# Altium schematic sheet mcu.SchDoc
size A4
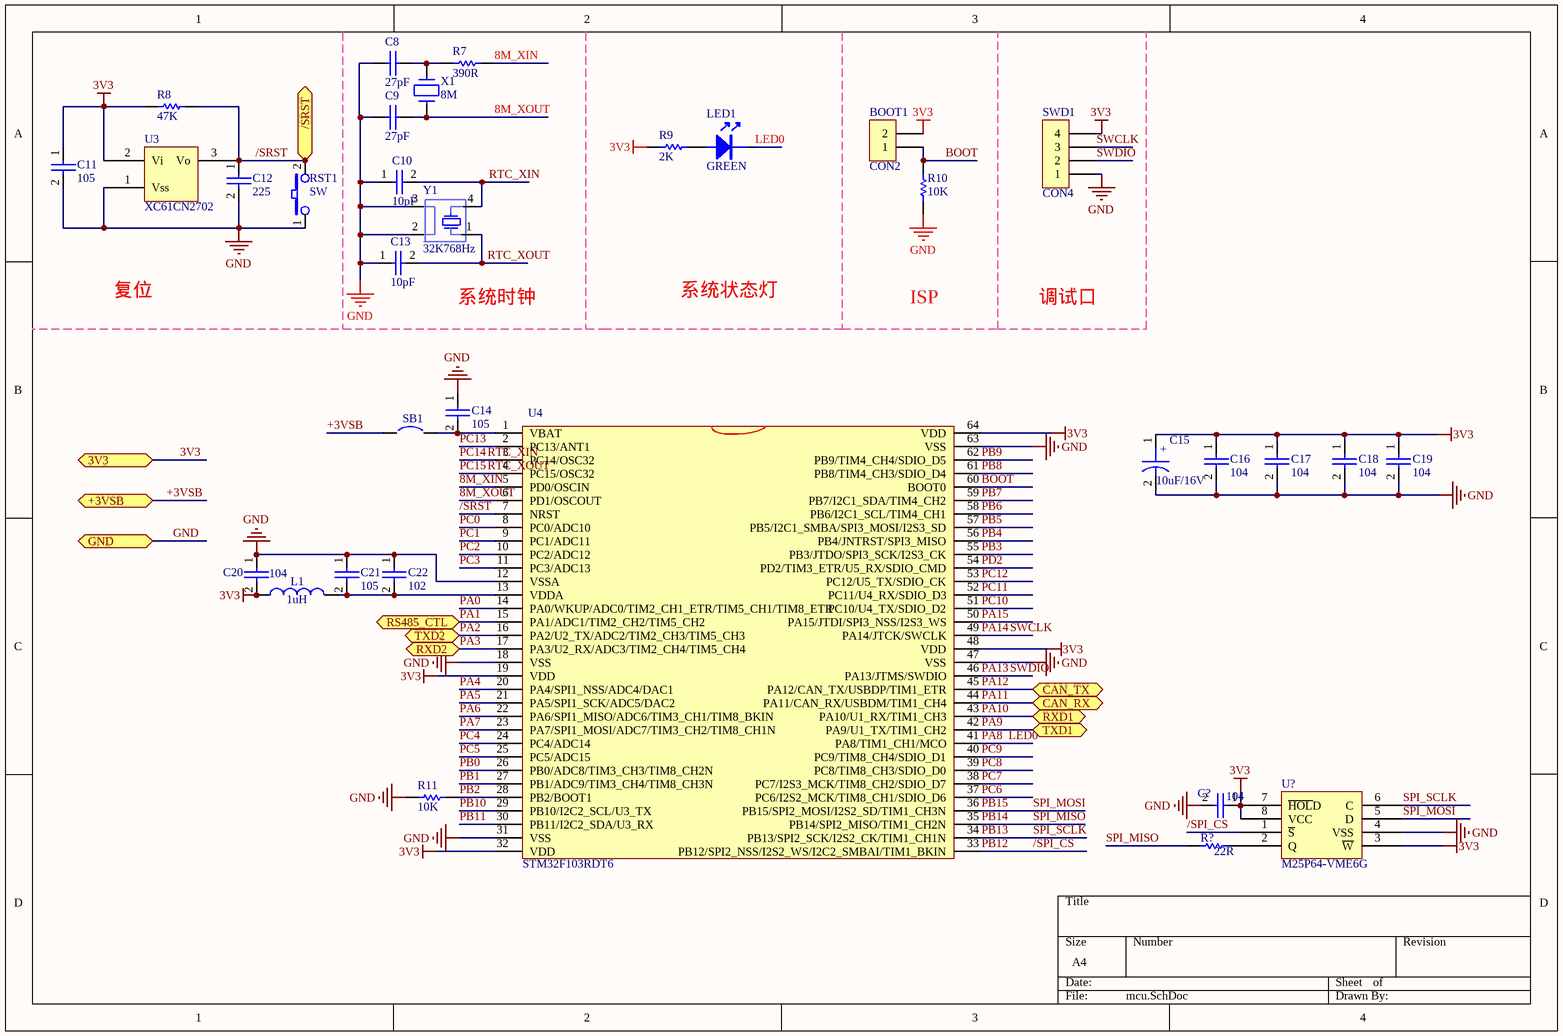
[diagram p0: mcu.SchDoc]

## Parts
BOOT1  CON2  [SIP2]
C8  27pF  [0603C]
C9  27pF  [0603C]
C10  10pF  [0603C]
C11  105  [0603C]
C12  225  [0805]
C13  10pF  [0603C]
C14  105  [0603C]
C15  10uF/16V  [TAN-B]
C16  104  [0603C]
C17  104  [0603C]
C18  104  [0603C]
C19  104  [0603C]
C20  104  [0603C]
C21  105  [0603C]
C22  102  [0603C]
C?  104  [0603C]
L1  1uH  [0603C]
LED1  GREEN  [LED-0603]
R7  390R  [0603C]
R8  47K  [0603C]
R9  2K  [0603C]
R10  10K  [0603C]
R11  10K  [0603R]
R?  22R  [0603C]
RST1  SW  [5032-s]
SB1  Circuit Breaker  [JP2_SMD-2]  (value not drawn)
SWD1  CON4  [SIP4]
U3  XC61CN2702  [XC61CN2702]
U4  STM32F103RDT6  [LQFP64_M]
U?  M25P64-VME6G  [VDFPN8]
X1  8M  [XTAL]
Y1  32K768Hz  [32K768Hz]

## Ports
3V3, +3VSB, /SRST, CAN_RX, CAN_TX, GND, RS485_CTL, RXD1, RXD2, TXD1, TXD2

## Nets
3V3: BOOT1.2 C11.1 C15.1 C16.1 C17.1 C18.1 C19.1 C20.2 C?.1 L1.1 R8.1 R9.2 SWD1.4 U3.2(Vi) U4.19(VDD) U4.32(VDD) U4.48(VDD) U4.64(VDD) U?.3(~{W}) U?.7(~{HOL}D) U?.8(VCC) ; port 3V3
GND: C8.1 C9.1 C10.1 C11.2 C12.2 C13.1 C14.1 C15.2 C16.2 C17.2 C18.2 C19.2 C20.1 C21.1 C22.1 C?.2 R10.1 R11.2 RST1.1 SWD1.1 U3.1(Vss) U4.12(VSSA) U4.18(VSS) U4.31(VSS) U4.47(VSS) U4.63(VSS) U?.4(VSS) Y1.2 Y1.3 ; port GND
8M_XIN: R7.1 U4.5(PD0/OSCIN)
8M_XOUT: C9.2 U4.6(PD1/OSCOUT) X1.1
+3VSB: SB1.1 ; port +3VSB
/SPI_CS: U4.33(PB12/SPI2_NSS/I2S2_WS/I2C2_SMBAI/TIM1_BKIN) U?.1(~{S})  [also labelled PB12]
/SRST: C12.1 R8.2 RST1.2 U3.3(Vo) U4.7(NRST) ; port /SRST
BOOT: BOOT1.1 R10.2 U4.60(BOOT0)
LED0: LED1.2 U4.41(PA8/TIM1_CH1/MCO)  [also labelled PA8]
PA0: U4.14(PA0/WKUP/ADC0/TIM2_CH1_ETR/TIM5_CH1/TIM8_ETR)
PA1: U4.15(PA1/ADC1/TIM2_CH2/TIM5_CH2) ; port RS485_CTL
PA2: U4.16(PA2/U2_TX/ADC2/TIM2_CH3/TIM5_CH3) ; port TXD2
PA3: U4.17(PA3/U2_RX/ADC3/TIM2_CH4/TIM5_CH4) ; port RXD2
PA4: U4.20(PA4/SPI1_NSS/ADC4/DAC1)
PA5: U4.21(PA5/SPI1_SCK/ADC5/DAC2)
PA6: U4.22(PA6/SPI1_MISO/ADC6/TIM3_CH1/TIM8_BKIN)
PA7: U4.23(PA7/SPI1_MOSI/ADC7/TIM3_CH2/TIM8_CH1N)
PA9: U4.42(PA9/U1_TX/TIM1_CH2) ; port TXD1
PA10: U4.43(PA10/U1_RX/TIM1_CH3) ; port RXD1
PA11: U4.44(PA11/CAN_RX/USBDM/TIM1_CH4) ; port CAN_RX
PA12: U4.45(PA12/CAN_TX/USBDP/TIM1_ETR) ; port CAN_TX
PA13: SWD1.2 U4.46(PA13/JTMS/SWDIO)  [also labelled SWDIO]
PA14: SWD1.3 U4.49(PA14/JTCK/SWCLK)  [also labelled SWCLK]
PA15: U4.50(PA15/JTDI/SPI3_NSS/I2S3_WS)
PB0: U4.26(PB0/ADC8/TIM3_CH3/TIM8_CH2N)
PB1: U4.27(PB1/ADC9/TIM3_CH4/TIM8_CH3N)
PB2: R11.1 U4.28(PB2/BOOT1)
PB3: U4.55(PB3/JTDO/SPI3_SCK/I2S3_CK)
PB4: U4.56(PB4/JNTRST/SPI3_MISO)
PB5: U4.57(PB5/I2C1_SMBA/SPI3_MOSI/I2S3_SD)
PB6: U4.58(PB6/I2C1_SCL/TIM4_CH1)
PB7: U4.59(PB7/I2C1_SDA/TIM4_CH2)
PB8: U4.61(PB8/TIM4_CH3/SDIO_D4)
PB9: U4.62(PB9/TIM4_CH4/SDIO_D5)
PB10: U4.29(PB10/I2C2_SCL/U3_TX)
PB11: U4.30(PB11/I2C2_SDA/U3_RX)
PB13: U4.34(PB13/SPI2_SCK/I2S2_CK/TIM1_CH1N) U?.6(C)  [also labelled SPI_SCLK]
PB14: R?.1 U4.35(PB14/SPI2_MISO/TIM1_CH2N)  [also labelled SPI_MISO]
PB15: U4.36(PB15/SPI2_MOSI/I2S2_SD/TIM1_CH3N) U?.5(D)  [also labelled SPI_MOSI]
PC0: U4.8(PC0/ADC10)
PC1: U4.9(PC1/ADC11)
PC2: U4.10(PC2/ADC12)
PC3: U4.11(PC3/ADC13)
PC4: U4.24(PC4/ADC14)
PC5: U4.25(PC5/ADC15)
PC6: U4.37(PC6/I2S2_MCK/TIM8_CH1/SDIO_D6)
PC7: U4.38(PC7/I2S3_MCK/TIM8_CH2/SDIO_D7)
PC8: U4.39(PC8/TIM8_CH3/SDIO_D0)
PC9: U4.40(PC9/TIM8_CH4/SDIO_D1)
PC10: U4.51(PC10/U4_TX/SDIO_D2)
PC11: U4.52(PC11/U4_RX/SDIO_D3)
PC12: U4.53(PC12/U5_TX/SDIO_CK)
PC13: U4.2(PC13/ANT1)
PC14: C10.2 U4.3(PC14/OSC32) Y1.4  [also labelled RTC_XIN]
PC15: C13.2 U4.4(PC15/OSC32) Y1.1  [also labelled RTC_XOUT]
PD2: U4.54(PD2/TIM3_ETR/U5_RX/SDIO_CMD)
NetC8_2: C8.2 R7.2 X1.2
NetC14_2: C14.2 SB1.2 U4.1(VBAT)
NetC21_2: C21.2 C22.2 L1.2 U4.13(VDDA)
NetLED1_1: LED1.1 R9.1
NetR?_2: R?.2 U?.2(Q)

## Notes on the sheet
- 复位
- 系统时钟
- 系统状态灯
- ISP
- 调试口
- (in symbol CAPACITOR POL_0) +

## Library data of the parts
BOOT1 = CON2: Connector
C8-C14 C16-C22 C? = CAP: Capacitor
C15 = CAPACITOR POL_0: Text Field1: 20; Text Field2: 20
L1 = Inductor: Value: 100uH; Published: 8-Jun-2000; Revision: July-2002: Re-released for DXP Platform.; Publisher: Altium Limited
LED1 = LED
R7 R10 R? = Res1: Resistor; Value: 1K; Published: 8-Jun-2000; Revision: July-2002: Re-released for DXP Platform.; Publisher: Altium Limited
R8 R9 R11 = res1: Resistor; Value: 1K; Published: 8-Jun-2000; Revision: July-2002: Re-released for DXP Platform.; Publisher: Altium Limited
RST1 = SW_PUSH: Text Field1: 30; Text Field2: 30
SB1 = Circuit Breaker: Solder: NO; Published: 24-Mar-1999; Revision: July-2002: Re-released for DXP Platform.; Publisher: Altium Limited
SWD1 = CON4: Connector
X1 = CRYSTAL: Part Field 1: 1; Part Field 5: 1; Part Field 6: 1000K